# EAGLE schematic pro_micro_adapter (EAGLE 9.6.2)
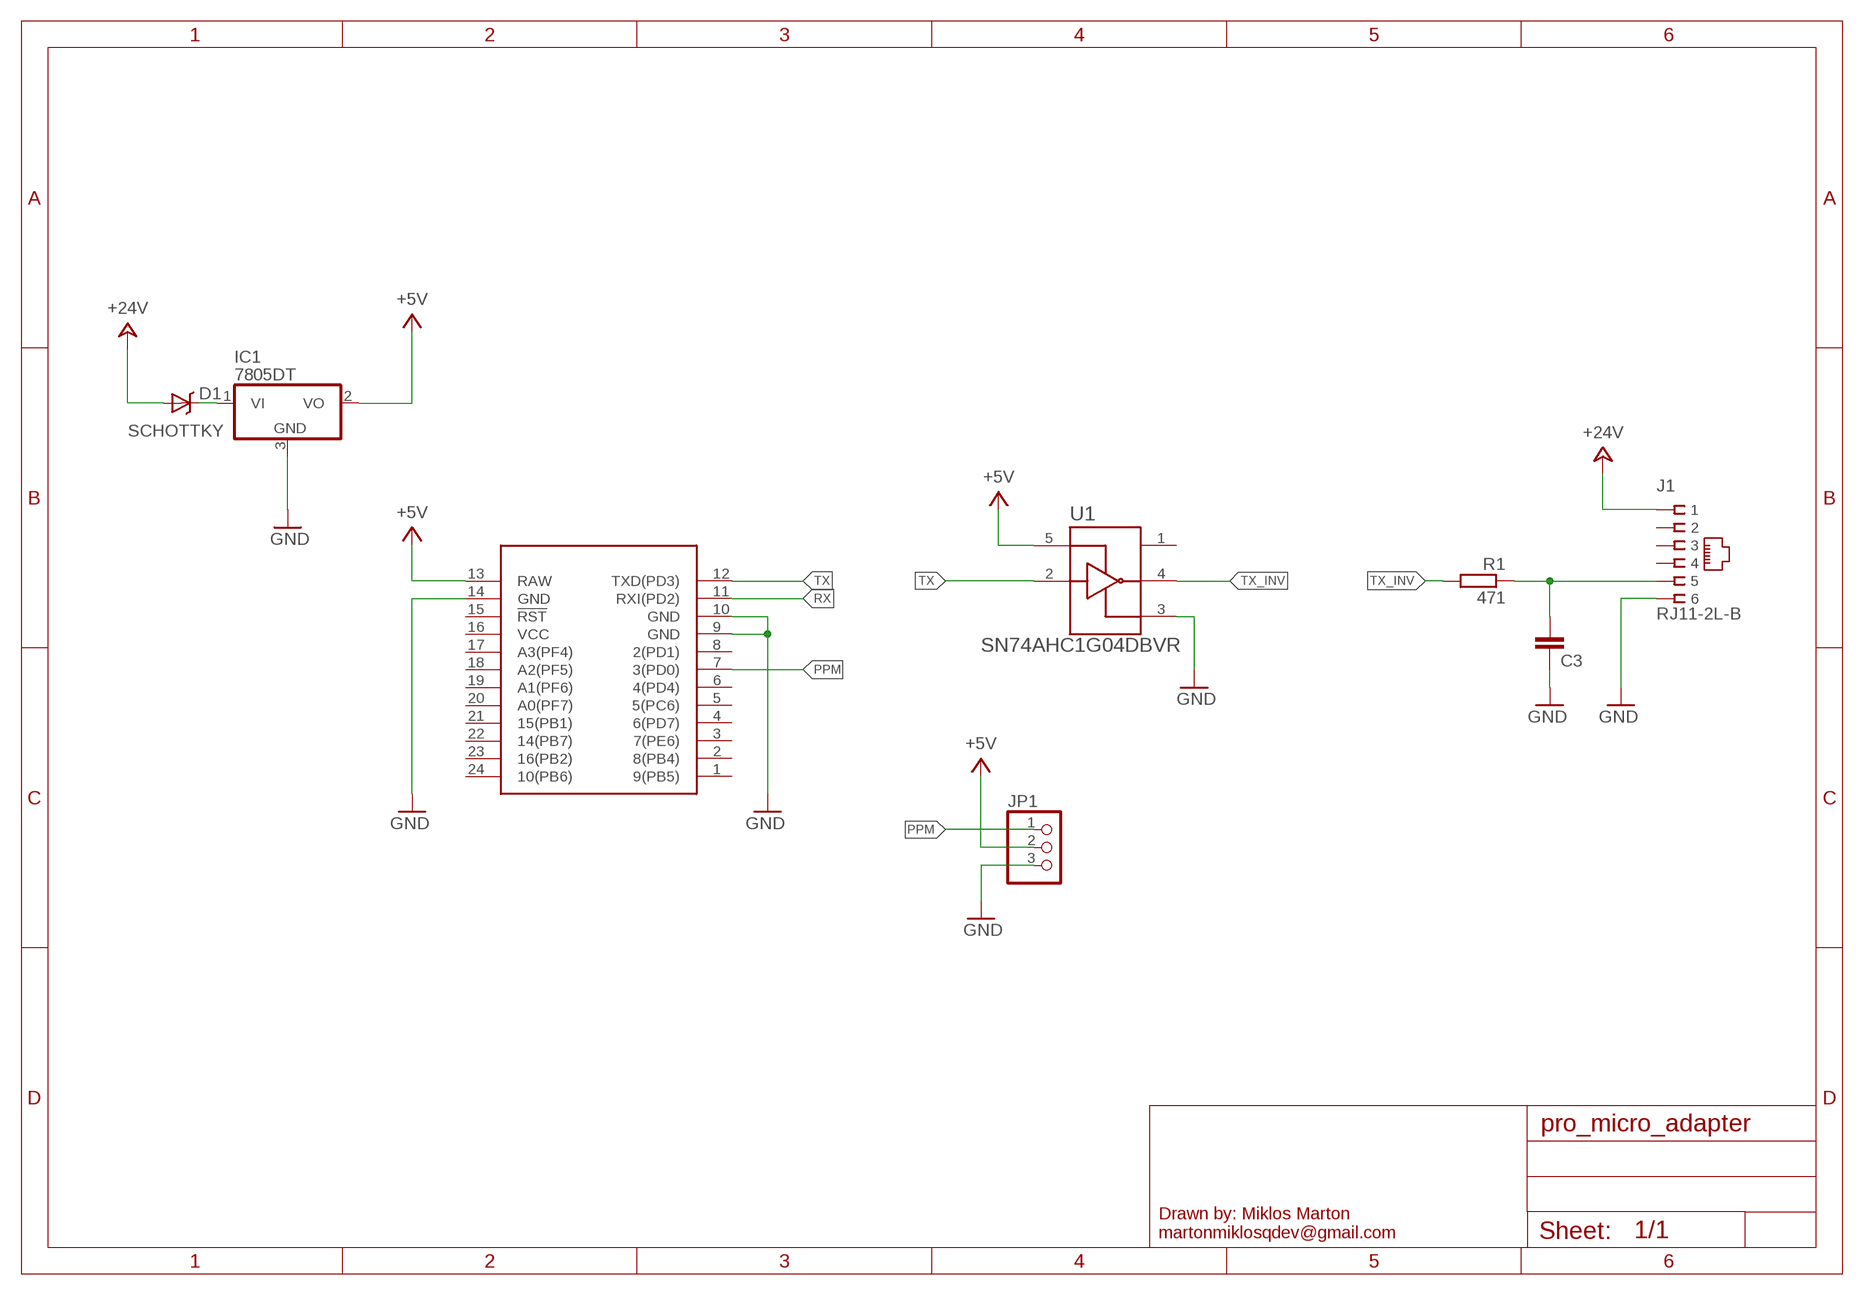
[diagram p0: schematic, sheet 1]

## Parts
C3  C-EUC0805  [C0805]
D1  SCHOTTKY  [DO-214AC]
IC1  7805DT  [TO252]
J1  RJ11-2L-B  [RJ11-NO_SHIELD]
JP1  PINHD-1X3  [1X03]
R1  471  R-EU_R0805  [R0805]
U1  SN74AHC1G04DBVR  [SOT95P280X145-5N]
U$1  ARDUINO_MICRO_PRO  [ARDUINO_MICRO_PRO]

## Nets
+5V: IC1.2(VO) JP1.2 U1.5(VCC) U$1.13(RAW)
+24V: D1.A J1.1
GND: C3.1 IC1.3(GND) J1.6 JP1.3 U1.3(GND) U$1.9(GND) U$1.10(GND) U$1.14(GND)
N$1: D1.C IC1.1(VI)
PPM: JP1.1 U$1.7(3(PD0))
RX: U$1.11(RXI(PD2))
TX: U1.2(A) U$1.12(TXD(PD3))
TX_INV: R1.2 U1.4(Y)
TX_R: C3.2 J1.5 R1.1
Unconnected: J1.2 J1.3 J1.4 U1.1(NC) U$1.1(9(PB5)) U$1.2(8(PB4)) U$1.3(7(PE6)) U$1.4(6(PD7)) U$1.5(5(PC6)) U$1.6(4(PD4)) U$1.8(2(PD1)) U$1.15(!RST) U$1.17(A3(PF4)) U$1.18(A2(PF5)) U$1.19(A1(PF6)) U$1.20(A0(PF7)) U$1.21(15(PB1)) U$1.22(14(PB7)) U$1.23(16(PB2)) U$1.24(10(PB6))

## Power pins joined to a net without a drawn wire
VCC: U$1.16(VCC)

## Library data of the parts
C3 = rcl:C-EU: CAPACITOR, European symbol
D1 = Ava2:SCHOTTKY
IC1 = linear:78*: Positive VOLTAGE REGULATOR Source: http://cache.national.com/ds/LM/LM78L05.pdf http://www.fairchildsemi.com/ds/LM/LM7805.pdf
J1 = con-tycoelectronics:RJ11: CORCOM Modular RJ Jacks No Shield Source: www.tycoelectronics.com .. ENG_DS_1654001_1099_RJ_L_0507.pdf; MF: TYCO ELECTRONICS; MPN: RJ11-2L-B; OC_FARNELL: unknown; OC_NEWARK: 83F4463
JP1 = pinhead:PINHD-1X3: PIN HEADER
R1 = rcl:R-EU_: RESISTOR, European symbol
U1 = SN74AHC1G04DBVR:SN74AHC1G04DBVR: Single Inverter 5-SOT-23 -40 to 125 Check availability <https://pricing.snapeda.com/parts/SN74AHC1G04DBVR/Texas%20Instruments/view-part?ref=eda>; AVAILABILITY: In Stock; DESCRIPTION: Single Inverter Gate 5-SOT-23 -40 to 125; MF: Texas Instruments; MP: SN74AHC1G04DBVR; PACKAGE: SOT-23-5 Texas Instruments; PRICE: None; PURCHASE-URL: https://pricing.snapeda.com/search/part/SN74AHC1G04DBVR/?ref=eda
U$1 = E14_Arduino_revB:ARDUINO_MICRO_PRO